# Altium project LimeNet-Micro_2v0.PrjPcb (part 9 of 9)
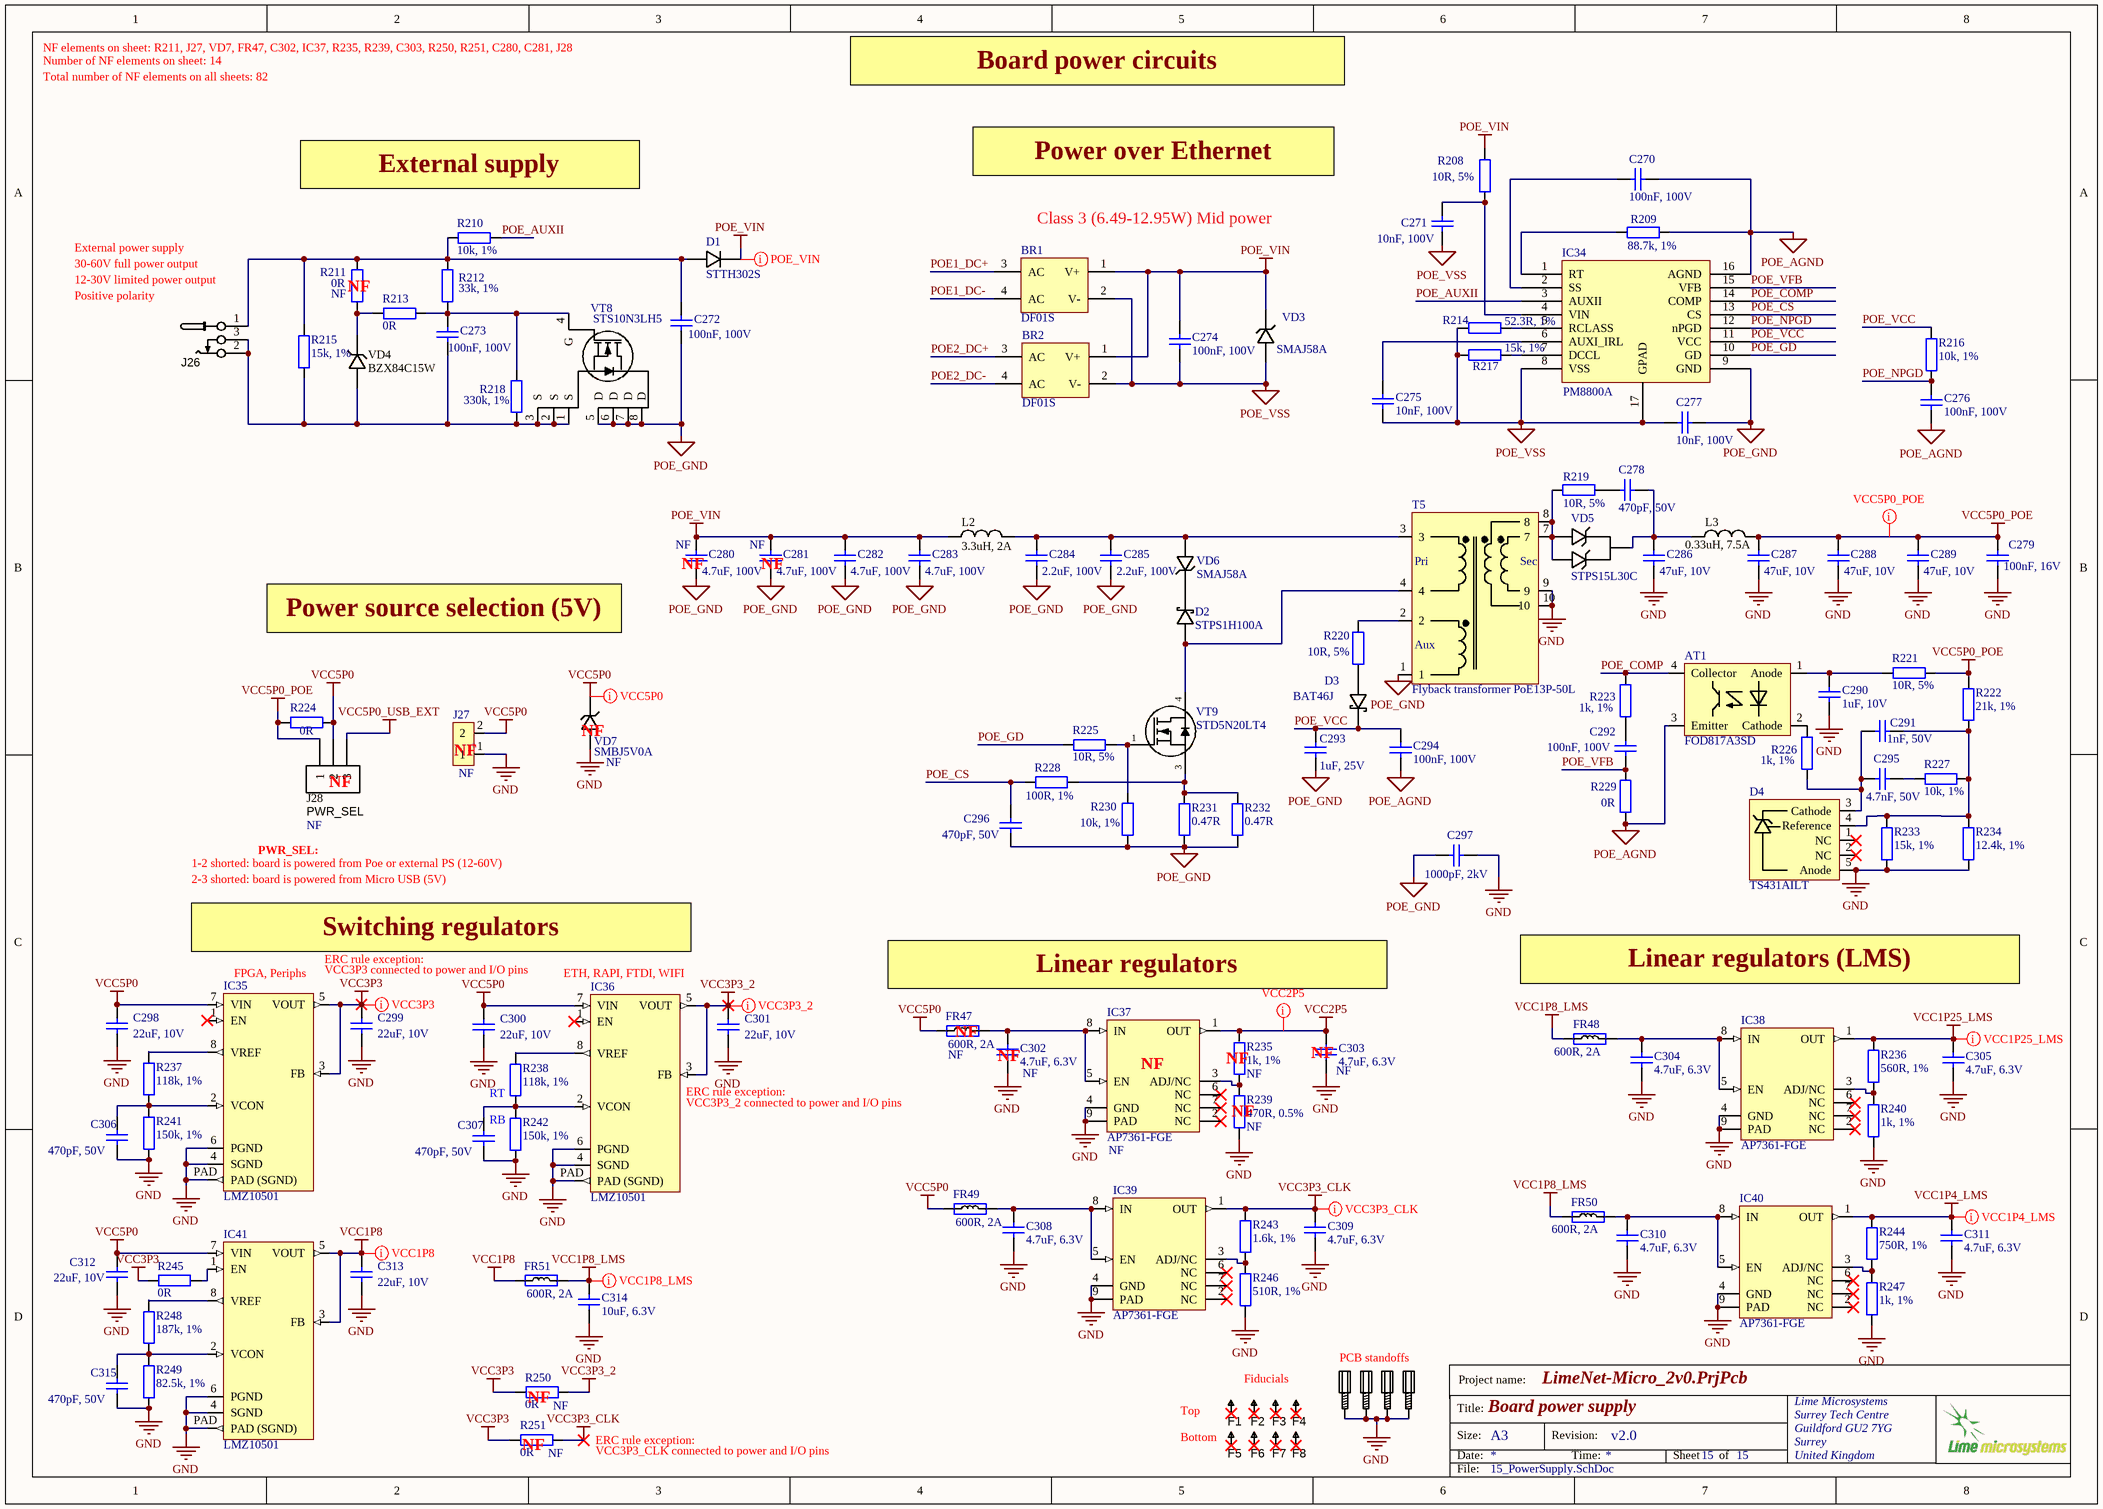
[diagram p16: 15_PowerSupply.SchDoc]

## Sheet 15_PowerSupply.SchDoc: Board power supply (continued)

### Library data of the parts (continued)
VD4 = BZX84C15W_DIODE_ZENER: Part Description: Zener Diode 15V 200mW ±6% Surface Mount SOT-323; Manufacturer: Diodes; Manufacturer Part Number 1: BZX84C15W-7-F; Max Power Dissipation: 200mW; Tolerance: 6%; Zener Voltage: 15V; Impedance: 30R; Max Reverse Leakage Current: 100nA; Zener Current: 5mA; Element Configuration: Single; Output Current: 23mA; ESD Protection: No; ComponentLink1URL: http://www.onsemi.com/pub/Collateral/BZX84C2V4LT1-D.PDF; ComponentLink1Description: http://www.onsemi.com/pub/Collateral/BZX84C2V4LT1-D.PDF; ComponentLink2URL: https://www.verical.com/server-webapp/html/getDatasheet?partID=101861; ComponentLink2Description: https://www.verical.com/server-webapp/html/getDatasheet?partID=101861; ComponentLink3URL: http://www.farnell.com/datasheets/1874542.pdf; ComponentLink3Description: http://www.farnell.com/datasheets/1874542.pdf; ComponentLink4URL: https://www.alliedelec.com/m/d/89a0f5fa5faf07909887b6182710b562.pdf; ComponentLink4Description: https://www.alliedelec.com/m/d/89a0f5fa5faf07909887b6182710b562.pdf; ComponentLink5URL: https://www.onsemi.com/pub/Collateral/BZX84C2V4LT1-D.PDF; ComponentLink5Description: https://www.onsemi.com/pub/Collateral/BZX84C2V4LT1-D.PDF; ComponentLink6URL: http://www.onsemi.com/pub_link/Collateral/BZX84C2V4LT1-D.PDF; ComponentLink6Description: http://www.onsemi.com/pub_link/Collateral/BZX84C2V4LT1-D.PDF; Supplier 1: Digi-Key; Stock 1: 4066; Pricing 1: 1=0.38, 10=0.284, 100=0.161, 500=0.1066, 1000=0.08173 (USD); Mount: Surface Mount; Case/Package: SOT-323; Number of Pins: 3; Weight: 0.000212oz; Contact Plating: Matte,Tin; Min Operating Temperature: -65°C; Max Operating Temperature: 125°C; Packaging: Tape and Reel; Package Quantity: 3000; Power Dissipation: 200mW; Voltage Tolerance: 6%; Test Current: 5mA; Termination: SMD/SMT; Peak Reverse Current: 100nA; Power Rating: 200mW; Voltage Rating (DC): 15V; Length: 2.2mm; Height: 1mm; Width: 1.35mm; Radiation Hardening: No; Lead Free: Lead Free; ComponentLink7URL: http://www.diodes.com/datasheets/ds30066.pdf; ComponentLink7Description: http://www.diodes.com/datasheets/ds30066.pdf; ComponentLink8URL: https://www.diodes.com/assets/Datasheets/ds30066.pdf; ComponentLink8Description: https://www.diodes.com/assets/Datasheets/ds30066.pdf; ComponentLink9URL: http://www.diodes.com//datasheets/ds30066.pdf; ComponentLink9Description: http://www.diodes.com//datasheets/ds30066.pdf; Supplier Part Number 1: BZX84C15W-FDIDKR-ND
VD5 = STPS15L30C_shottky_rectifier: Part Description: Diode Array 1 Pair Common Cathode Schottky 30V 7.5A Surface Mount TO-252-3, DPak (2 Leads + Tab), SC-63; Manufacturer: STMicroelectronics; Manufacturer Part Number 1: STPS15L30CB-TR; Element Configuration: Common Cathode; Forward Current: 15A; Peak Reverse Current: 1mA; Forward Voltage: 570mV; Average Rectified Current: 7.5A; Max Repetitive Reverse Voltage (Vrrm): 30V; Max Forward Surge Current (Ifsm): 75A; Supplier 1: Digi-Key; Stock 1: 5072; Pricing 1: 1=1.48, 10=1.327, 100=1.0343, 500=0.8544, 1000=0.67453 (USD); Mount: Surface Mount; Case/Package: DPAK; Number of Pins: 3; Contact Plating: Matte,Tin; Min Operating Temperature: -65°C; Max Operating Temperature: 150°C; Package Quantity: 2500; Packaging: Tape and Reel; Peak Non-Repetitive Surge Current: 75A; Current Rating: 15A; Voltage Rating (DC): 30V; Max Reverse Voltage (DC): 30V; Radiation Hardening: No; Lead Free: Lead Free; ComponentLink1URL: http://www.st.com/content/ccc/resource/technical/document/datasheet/1f/cc/d5/79/c8/b2/47/15/CD00002832.pdf/files/CD00002832.pdf/jcr:content/translations/en.CD00002832.pdf; ComponentLink1Description: http://www.st.com/content/ccc/resource/technical/document/datasheet/1f/cc/d5/79/c8/b2/47/15/CD00002832.pdf/files/CD00002832.pdf/jcr:content/translations/en.CD00002832.pdf; ComponentLink2URL: http://www.mouser.com/ds/2/389/stps15l30c-956623.pdf; ComponentLink2Description: http://www.mouser.com/ds/2/389/stps15l30c-956623.pdf; Supplier Part Number 1: 497-6574-6-ND
VD7 = DIODE_TVS_UNIDIR: SMAJ12CA-13-F; Manufacturer: ON Semiconductor; Part Description: TVS DIODE 5V 9.2V DO214AA; Voltage - Breakdown (Min): 6.4V; Type: Zener; Voltage - Clamping (Max) @ Ipp: 9.2V; Power Line Protection: No; Voltage - Reverse Standoff (Typ): 5V; Current - Peak Pulse (10/1000µs): 65.2A; Power - Peak Pulse: 600W; Category: Circuit Protection; Packaging: Cut Tape (CT); Operating Temperature: -55°C ~ 150°C (TJ); Package / Case: DO-214AA, SMB; Supplier Part Number 1: SMBJ5V0ACT-ND; Part Status: Discontinued at Digi-Key; Manufacturer Part Number 1: SMBJ5V0A; Supplier Device Package: DO-214AA (SMB); Mounting Type: Surface Mount; Supplier 1: Digi-Key; RoHS: RoHS Compliant; Base Part Number: SMBJ5V0; Applications: General Purpose; Capacitance @ Frequency: -; Value: SMBJ5V0A
VT8 = STS10N3LH5_NMOS: Part Description: N-Channel 30V 10A (Tc) 2.5W (Tc) Surface Mount 8-SO; Manufacturer: STMicroelectronics; Rds On Max: 21mR; Input Capacitance: 475pF; Rise Time: 22ns; Drain to Source Voltage (Vdss): 30V; Continuous Drain Current (ID): 10A; Max Power Dissipation: 2.5W; Turn-On Delay Time: 4ns; Turn-Off Delay Time: 13ns; Fall Time: 2.8ns; Gate to Source Voltage (Vgs): 22V; ComponentLink1URL: http://www.st.com/web/en/resource/technical/document/datasheet/CD00103832.pdf; ComponentLink1Description: http://www.st.com/web/en/resource/technical/document/datasheet/CD00103832.pdf; ComponentLink2URL: http://www.st.com/content/ccc/resource/technical/document/datasheet/00/75/48/c3/62/90/4a/32/CD00103832.pdf/files/CD00103832.pdf/jcr:content/translations/en.CD00103832.pdf; ComponentLink2Description: http://www.st.com/content/ccc/resource/technical/document/datasheet/00/75/48/c3/62/90/4a/32/CD00103832.pdf/files/CD00103832.pdf/jcr:content/translations/en.CD00103832.pdf; ComponentLink3URL: http://www.mouser.com/ds/2/389/CD00103832-114014.pdf; ComponentLink3Description: http://www.mouser.com/ds/2/389/CD00103832-114014.pdf; Supplier 1: Digi-Key; Manufacturer Part Number: STS10N3LH5; Stock 1: 4194; Pricing 1: 1=1.38, 10=1.219, 100=0.9632, 500=0.74698, 1000=0.58973 (USD); Mount: Surface Mount; Case/Package: SOIC; Number of Pins: 8; Min Operating Temperature: -55°C; Max Operating Temperature: 150°C; Package Quantity: 2500; Packaging: Tape and Reel; Radiation Hardening: No; Lead Free: Lead Free; ComponentLink4URL: http://www.st.com/web/en/resource/technical/document/datasheet/CD00232229.pdf; ComponentLink4Description: http://www.st.com/web/en/resource/technical/document/datasheet/CD00232229.pdf; ComponentLink5URL: http://www.st.com/content/ccc/resource/technical/document/datasheet/53/fc/cf/05/f9/85/43/7e/CD00232229.pdf/files/CD00232229.pdf/jcr:content/translations/en.CD00232229.pdf; ComponentLink5Description: http://www.st.com/content/ccc/resource/technical/document/datasheet/53/fc/cf/05/f9/85/43/7e/CD00232229.pdf/files/CD00232229.pdf/jcr:content/translations/en.CD00232229.pdf; Supplier Part Number 1: 497-10010-1-ND
VT9 = STD5N20LT4_NMOS: Manufacturer: STMicroelectronics; Part Description: N-Channel 200V 5A (Tc) 33W (Tc) Surface Mount DPAK; Nominal Vgs: 2.5V; Rise Time: 21.5ns; Rds On Max: 700mR; Input Capacitance: 242pF; Number of Elements: 1; Max Power Dissipation: 33W; Dual Supply Voltage: 200V; Continuous Drain Current (ID): 5A; Fall Time: 15.5ns; Drain to Source Resistance: 650mR; Turn-Off Delay Time: 14ns; Turn-On Delay Time: 11.5ns; Element Configuration: Single; Gate to Source Voltage (Vgs): 20V; Supplier 1: Digi-Key; Manufacturer Part Number 1: STD5N20LT4; Stock 1: 3027; Pricing 1: 1=1.17, 10=1.033, 100=0.8161, 500=0.6329, 1000=0.49965 (USD); Mount: Surface Mount; Case/Package: DPAK; Number of Pins: 3; Min Operating Temperature: -55°C; Max Operating Temperature: 150°C; Packaging: Tape and Reel; Package Quantity: 2500; Drain to Source Voltage (Vdss): 200V; Drain to Source Breakdown Voltage: 200V; Power Dissipation: 33W; On-State Resistance: 700mR; Threshold Voltage: 2.5V; Termination: SMD/SMT; Voltage Rating (DC): 200V; Current Rating: 5A; Length: 6.6mm; Height: 2.4mm; Width: 6.2mm; Radiation Hardening: No; REACH SVHC: No SVHC; Lead Free: Lead Free; ComponentLink1URL: http://www.farnell.com/datasheets/1689960.pdf; ComponentLink1Description: http://www.farnell.com/datasheets/1689960.pdf; ComponentLink2URL: http://www.st.com/content/ccc/resource/technical/document/datasheet/group2/51/4c/d5/e5/c6/ef/43/17/CD00043538/files/CD00043538.pdf/jcr:content/translations/en.CD00043538.pdf; ComponentLink2Description: http://www.st.com/content/ccc/resource/technical/document/datasheet/group2/51/4c/d5/e5/c6/ef/43/17/CD00043538/files/CD00043538.pdf/jcr:content/translations/en.CD00043538.pdf; ComponentLink3URL: http://www.st.com/web/en/resource/technical/document/datasheet/CD00043538.pdf; ComponentLink3Description: http://www.st.com/web/en/resource/technical/document/datasheet/CD00043538.pdf; Supplier Part Number 1: 497-4335-6-ND

## Nets that join several sheets
GND: 05_LMS7002M_Misc (17 pins), 06_LMS7002M_RF (44 pins), 07_LMS7002M_Power (84 pins), 08_FPGA (62 pins), 09_Misc (63 pins), 10_USB_Ethernet (47 pins), 11_USB_FIFO (33 pins), 12_Raspbbery CM3 (80 pins), 13_Raspberry_Misc (72 pins), 14_Clocks (74 pins), 15_PowerSupply (60 pins)
RAPI_VDAC: 12_Raspbbery CM3 (C197.2 J13.189 R133.1 R137.2), 13_Raspberry_Misc (VD2.2)
VCC1P4_LMS: 07_LMS7002M_Power (7 pins), 15_PowerSupply (C311.2 IC40.1 R244.1)
VCC1P8: 08_FPGA (11 pins), 09_Misc (R53.2 R79.1), 12_Raspbbery CM3 (R127.2 R134.1 R141.1), 13_Raspberry_Misc (5 pins), 14_Clocks (FR44.1), 15_PowerSupply (C313.2 FR51.1 IC41.3 IC41.5)
VCC1P8_LMS: 06_LMS7002M_RF (12 pins), 07_LMS7002M_Power (11 pins), 15_PowerSupply (C314.2 FR48.1 FR50.1 FR51.2)
VCC1P25_LMS: 07_LMS7002M_Power (18 pins), 15_PowerSupply (C305.2 IC38.1 R236.2)
VCC2P5: 12_Raspbbery CM3 (R137.1), 14_Clocks (R195.2), 15_PowerSupply (C303.2 IC37.1 R235.2)
VCC3P3: 05_LMS7002M_Misc (10 pins), 07_LMS7002M_Power (FR1.2), 08_FPGA (46 pins), 09_Misc (39 pins), 10_USB_Ethernet (J9.P6 J9.P12), 13_Raspberry_Misc (6 pins), 15_PowerSupply (6 pins)
VCC3P3_2: 10_USB_Ethernet (22 pins), 11_USB_FIFO (21 pins), 12_Raspbbery CM3 (13 pins), 13_Raspberry_Misc (19 pins), 15_PowerSupply (C301.2 IC36.3 IC36.5 R250.1)
VCC3P3_CLK: 09_Misc (FR36.1), 13_Raspberry_Misc (C215.1 IC28.5), 14_Clocks (12 pins), 15_PowerSupply (C309.2 IC39.1 R243.2 R251.1)
VCC5P0: 08_FPGA (J3.7 R43.1), 09_Misc (R71.1), 10_USB_Ethernet (5 pins), 11_USB_FIFO (R114.2), 12_Raspbbery CM3 (R130.2), 13_Raspberry_Misc (5 pins), 15_PowerSupply (12 pins)
VCC5P0_USB_EXT: 10_USB_Ethernet (J12.4), 12_Raspbbery CM3 (J14.1 R132.1), 13_Raspberry_Misc (J15.1), 15_PowerSupply (J28.3)
ADF_MUXOUT: 08_FPGA (IC8.C10), 14_Clocks (IC32.15 R197.1)
BUZZER: 08_FPGA (IC8.D13), 09_Misc (R81.1 R83.1 VT2.G)
CAM1_CLK_N: 12_Raspbbery CM3 (J13.149), 13_Raspberry_Misc (J23.8)
CAM1_CLK_P: 12_Raspbbery CM3 (J13.147), 13_Raspberry_Misc (J23.9)
CAM1_D0_N: 12_Raspbbery CM3 (J13.161), 13_Raspberry_Misc (J23.2)
CAM1_D0_P: 12_Raspbbery CM3 (J13.159), 13_Raspberry_Misc (J23.3)
CAM1_D1_N: 12_Raspbbery CM3 (J13.155), 13_Raspberry_Misc (J23.5)
CAM1_D1_P: 12_Raspbbery CM3 (J13.153), 13_Raspberry_Misc (J23.6)
CAM1_GPIO0: 12_Raspbbery CM3 (J13.59), 13_Raspberry_Misc (J23.11)
CAM1_GPIO1: 12_Raspbbery CM3 (J13.57), 13_Raspberry_Misc (J23.12)
DSI1_CLK_N: 12_Raspbbery CM3 (J13.102), 13_Raspberry_Misc (J22.5)
DSI1_CLK_P: 12_Raspbbery CM3 (J13.100), 13_Raspberry_Misc (J22.6)
DSI1_D0_N: 12_Raspbbery CM3 (J13.96), 13_Raspberry_Misc (J22.8)
DSI1_D0_P: 12_Raspbbery CM3 (J13.94), 13_Raspberry_Misc (J22.9)
DSI1_D1_N: 12_Raspbbery CM3 (J13.120), 13_Raspberry_Misc (J22.2)
DSI1_D1_P: 12_Raspbbery CM3 (J13.118), 13_Raspberry_Misc (J22.3)
ETH_AUTOMDIX_EN: 09_Misc (IC15.3), 10_USB_Ethernet (IC20.41 R88.1)
ETH_CLK24: 10_USB_Ethernet (IC20.45), 14_Clocks (R178.2)
ETH_GPIO0: 08_FPGA (IC8.C2), 10_USB_Ethernet (R97.2)
ETH_GPIO1: 08_FPGA (IC8.G4), 10_USB_Ethernet (R100.2)
ETH_GPIO2: 08_FPGA (IC8.H1), 10_USB_Ethernet (R102.2)
ETH_LED1: 09_Misc (IC13.2), 10_USB_Ethernet (R99.1)
ETH_LED2: 09_Misc (IC13.3), 10_USB_Ethernet (R101.1)
ETH_NRESET: 09_Misc (IC15.4), 10_USB_Ethernet (IC20.12 R87.1)
ETH_USB0_D_N: 10_USB_Ethernet (IC20.58 J12.2), 13_Raspberry_Misc (IC27.2)
ETH_USB0_D_P: 10_USB_Ethernet (IC20.59 J12.3), 13_Raspberry_Misc (IC27.1)
ETH_USB5_D_N: 10_USB_Ethernet (IC20.8), 11_USB_FIFO (IC23.25)
ETH_USB5_D_P: 10_USB_Ethernet (IC20.9), 11_USB_FIFO (IC23.23)
FAN_CTRL: 08_FPGA (IC8.C5 R52.2), 09_Misc (VT1.G)
FPGA_BTN: 08_FPGA (IC8.H3), 09_Misc (C133.1 R79.2 SB1.1)
FPGA_I2C_SCL: 08_FPGA (IC8.K10), 09_Misc (6 pins), 12_Raspbbery CM3 (R136.1 R139.1)
FPGA_I2C_SDA: 08_FPGA (IC8.B10), 09_Misc (6 pins), 12_Raspbbery CM3 (R142.1 R143.1)
FPGA_SPI_ADF_SS: 09_Misc (IC15.15), 14_Clocks (R202.1)
FPGA_SPI_DAC_SS: 09_Misc (IC15.1), 14_Clocks (R205.2)
FPGA_SPI_LMS_SS: 05_LMS7002M_Misc (R9.2), 08_FPGA (IC8.J5)
FPGA_SPI_MISO: 05_LMS7002M_Misc (R8.2), 08_FPGA (IC8.N5), 09_Misc (IC19.2)
FPGA_SPI_MOSI: 05_LMS7002M_Misc (R7.2), 08_FPGA (IC8.K5), 09_Misc (IC19.5), 14_Clocks (R201.1 R207.2)
FPGA_SPI_SCLK: 05_LMS7002M_Misc (R6.2), 08_FPGA (IC8.M5), 09_Misc (IC19.6), 14_Clocks (R200.1 R206.2)
FT_BE0: 08_FPGA (IC8.H9), 11_USB_FIFO (IC23.4)
FT_BE1: 08_FPGA (IC8.G12), 11_USB_FIFO (IC23.5)
FT_BE2: 08_FPGA (IC8.H8), 11_USB_FIFO (IC23.6)
FT_BE3: 08_FPGA (IC8.K11), 11_USB_FIFO (IC23.7)
FT_CLK: 08_FPGA (IC8.G9), 11_USB_FIFO (IC23.58)
FT_D0: 08_FPGA (IC8.A2), 11_USB_FIFO (IC23.40)
FT_D1: 08_FPGA (IC8.A3), 11_USB_FIFO (IC23.41)
FT_D2: 08_FPGA (IC8.A4), 11_USB_FIFO (IC23.42)
FT_D3: 08_FPGA (IC8.A5), 11_USB_FIFO (IC23.43)
FT_D4: 08_FPGA (IC8.A6), 11_USB_FIFO (IC23.44)
FT_D5: 08_FPGA (IC8.A7), 11_USB_FIFO (IC23.45)
FT_D6: 08_FPGA (IC8.A8), 11_USB_FIFO (IC23.46)
FT_D7: 08_FPGA (IC8.A9), 11_USB_FIFO (IC23.47)
FT_D8: 08_FPGA (IC8.A12), 11_USB_FIFO (IC23.50)
FT_D9: 08_FPGA (IC8.B13), 11_USB_FIFO (IC23.51)
FT_D10: 08_FPGA (IC8.C13), 11_USB_FIFO (IC23.52)
FT_D11: 08_FPGA (IC8.B2), 11_USB_FIFO (IC23.53)
FT_D12: 08_FPGA (IC8.B3), 11_USB_FIFO (IC23.54)
FT_D13: 08_FPGA (IC8.B4), 11_USB_FIFO (IC23.55)
FT_D14: 08_FPGA (IC8.B5), 11_USB_FIFO (IC23.56)
FT_D15: 08_FPGA (IC8.B6), 11_USB_FIFO (IC23.57)
FT_D16: 08_FPGA (IC8.D9), 11_USB_FIFO (IC23.60)
FT_D17: 08_FPGA (IC8.E6), 11_USB_FIFO (IC23.61)
FT_D18: 08_FPGA (IC8.E8), 11_USB_FIFO (IC23.62)
FT_D19: 08_FPGA (IC8.F9), 11_USB_FIFO (IC23.63)
FT_D20: 08_FPGA (IC8.E9), 11_USB_FIFO (IC23.64)
FT_D21: 08_FPGA (IC8.E10), 11_USB_FIFO (IC23.65)
FT_D22: 08_FPGA (IC8.F8), 11_USB_FIFO (IC23.66)
FT_D23: 08_FPGA (IC8.B11), 11_USB_FIFO (IC23.67)
FT_D24: 08_FPGA (IC8.B12), 11_USB_FIFO (IC23.69)
FT_D25: 08_FPGA (IC8.C11), 11_USB_FIFO (IC23.70)
FT_D26: 08_FPGA (IC8.C12), 11_USB_FIFO (IC23.71)
FT_D27: 08_FPGA (IC8.F12), 11_USB_FIFO (IC23.72)
FT_D28: 08_FPGA (IC8.G13), 11_USB_FIFO (IC23.73)
FT_D29: 08_FPGA (IC8.H13), 11_USB_FIFO (IC23.74)
FT_D30: 08_FPGA (IC8.J13), 11_USB_FIFO (IC23.75)
FT_D31: 08_FPGA (IC8.L13), 11_USB_FIFO (IC23.76)
FT_OEn: 08_FPGA (IC8.J9), 11_USB_FIFO (IC23.13)
FT_RDn: 08_FPGA (IC8.D12), 11_USB_FIFO (IC23.12)
FT_RESETn: 09_Misc (IC15.5), 11_USB_FIFO (C167.1 IC23.15 R118.1)
FT_RXFn: 08_FPGA (IC8.K12), 11_USB_FIFO (IC23.9)
FT_TXEn: 08_FPGA (IC8.J12), 11_USB_FIFO (IC23.8)
FT_WAKEUPn: 08_FPGA (IC8.H10), 11_USB_FIFO (IC23.16 R117.1)
FT_WRn: 08_FPGA (IC8.E12), 11_USB_FIFO (IC23.11)
GNSS _UART_TX: 08_FPGA (IC8.D8 R49.2), 09_Misc (IC10.20 R66.2)
GNSS_TPULSE: 08_FPGA (IC8.J10), 09_Misc (IC10.3)
GNSS_UART_RX: 08_FPGA (IC8.L12), 09_Misc (IC10.21 R67.1)
GNSS_USB_D_N: 09_Misc (IC10.5), 10_USB_Ethernet (R108.2)
GNSS_USB_D_P: 09_Misc (IC10.6), 10_USB_Ethernet (R109.2)
HDMI_CEC: 12_Raspbbery CM3 (J13.171), 13_Raspberry_Misc (R160.2 VT7.S)
HDMI_CLK_N: 12_Raspbbery CM3 (J13.111), 13_Raspberry_Misc (J19.12)
HDMI_CLK_P: 12_Raspbbery CM3 (J13.113), 13_Raspberry_Misc (J19.10)
HDMI_D0_N: 12_Raspbbery CM3 (J13.117), 13_Raspberry_Misc (J19.9)
HDMI_D0_P: 12_Raspbbery CM3 (J13.119), 13_Raspberry_Misc (J19.7)
HDMI_D1_N: 12_Raspbbery CM3 (J13.123), 13_Raspberry_Misc (J19.6)
HDMI_D1_P: 12_Raspbbery CM3 (J13.125), 13_Raspberry_Misc (J19.4)
HDMI_D2_N: 12_Raspbbery CM3 (J13.129), 13_Raspberry_Misc (J19.3)
HDMI_D2_P: 12_Raspbbery CM3 (J13.131), 13_Raspberry_Misc (J19.1)
HDMI_HPD_N: 12_Raspbbery CM3 (J13.88), 13_Raspberry_Misc (R161.2 VT6.D)
HDMI_I2C_SCL: 12_Raspbbery CM3 (J13.175), 13_Raspberry_Misc (J19.15 VD1.A3)
HDMI_I2C_SDA: 12_Raspbbery CM3 (J13.173), 13_Raspberry_Misc (J19.16 VD1.B3)
LM75_OS: 08_FPGA (IC8.H2), 09_Misc (IC9.3 R53.1)
LMK_CLK: 08_FPGA (IC8.H6), 14_Clocks (IC30.15)
LMS_CORE_LDO_EN: 05_LMS7002M_Misc (IC1.U33 R5.1), 09_Misc (IC13.5)
LMS_DIQ1_D0: 05_LMS7002M_Misc (IC1.AG31), 08_FPGA (IC8.N12)
LMS_DIQ1_D1: 05_LMS7002M_Misc (IC1.AF30), 08_FPGA (IC8.M12)
LMS_DIQ1_D2: 05_LMS7002M_Misc (IC1.AF34), 08_FPGA (IC8.N11)
LMS_DIQ1_D3: 05_LMS7002M_Misc (IC1.AE31), 08_FPGA (IC8.L10)
LMS_DIQ1_D4: 05_LMS7002M_Misc (IC1.AD30), 08_FPGA (IC8.N9)
LMS_DIQ1_D5: 05_LMS7002M_Misc (IC1.AC29), 08_FPGA (IC8.M13)
LMS_DIQ1_D6: 05_LMS7002M_Misc (IC1.AE33), 08_FPGA (IC8.M10)
LMS_DIQ1_D7: 05_LMS7002M_Misc (IC1.AD32), 08_FPGA (IC8.N10)
LMS_DIQ1_D8: 05_LMS7002M_Misc (IC1.AC31), 08_FPGA (IC8.M8)
LMS_DIQ1_D9: 05_LMS7002M_Misc (IC1.AC33), 08_FPGA (IC8.M9)
LMS_DIQ1_D10: 05_LMS7002M_Misc (IC1.AB30), 08_FPGA (IC8.K6)
LMS_DIQ1_D11: 05_LMS7002M_Misc (IC1.AB32), 08_FPGA (IC8.K7)
LMS_DIQ2_D0: 05_LMS7002M_Misc (IC1.H30), 08_FPGA (IC8.M1)
LMS_DIQ2_D1: 05_LMS7002M_Misc (IC1.J31), 08_FPGA (IC8.L5)
LMS_DIQ2_D2: 05_LMS7002M_Misc (IC1.K30), 08_FPGA (IC8.K2)
LMS_DIQ2_D3: 05_LMS7002M_Misc (IC1.K32), 08_FPGA (IC8.M2)
LMS_DIQ2_D4: 05_LMS7002M_Misc (IC1.L31), 08_FPGA (IC8.M4)
LMS_DIQ2_D5: 05_LMS7002M_Misc (IC1.K34), 08_FPGA (IC8.J1)
LMS_DIQ2_D6: 05_LMS7002M_Misc (IC1.M30), 08_FPGA (IC8.L2)
LMS_DIQ2_D7: 05_LMS7002M_Misc (IC1.M32), 08_FPGA (IC8.K1)
LMS_DIQ2_D8: 05_LMS7002M_Misc (IC1.N31), 08_FPGA (IC8.N4)
LMS_DIQ2_D9: 05_LMS7002M_Misc (IC1.N33), 08_FPGA (IC8.J2)
LMS_DIQ2_D10: 05_LMS7002M_Misc (IC1.P30), 08_FPGA (IC8.L4)
LMS_DIQ2_D11: 05_LMS7002M_Misc (IC1.P32), 08_FPGA (IC8.N2)
LMS_ENABLE_IQSEL1: 05_LMS7002M_Misc (IC1.Y32), 08_FPGA (IC8.N7)
LMS_ENABLE_IQSEL2: 05_LMS7002M_Misc (IC1.R33), 08_FPGA (IC8.N3)
LMS_FCLK1: 05_LMS7002M_Misc (IC1.AA33), 08_FPGA (IC8.L3)
LMS_FCLK2: 05_LMS7002M_Misc (IC1.R29), 08_FPGA (IC8.M3)
LMS_MCLK1: 05_LMS7002M_Misc (IC1.AB34), 08_FPGA (IC8.G5)
LMS_MCLK2: 05_LMS7002M_Misc (IC1.P34), 08_FPGA (IC8.H4)
LMS_RESET: 05_LMS7002M_Misc (IC1.E27 R2.1), 09_Misc (IC13.4)
LMS_RXEN: 05_LMS7002M_Misc (IC1.V34 R4.2), 09_Misc (IC13.6)
LMS_TXEN: 05_LMS7002M_Misc (IC1.U29 R3.2), 09_Misc (IC13.7)
LMS_TXNRX1: 05_LMS7002M_Misc (IC1.V32 R1.1), 08_FPGA (IC8.N6)
LMS_TXNRX2: 05_LMS7002M_Misc (IC1.U31 R10.1), 08_FPGA (IC8.H5)
POE1_DC+: 10_USB_Ethernet (J9.P10), 15_PowerSupply (BR1.3)
POE1_DC-: 10_USB_Ethernet (J9.P11), 15_PowerSupply (BR1.4)
POE2_DC+: 10_USB_Ethernet (J9.P8), 15_PowerSupply (BR2.3)
POE2_DC-: 10_USB_Ethernet (J9.P9), 15_PowerSupply (BR2.4)
RAPI_EMMC_EN: 08_FPGA (IC8.E1), 12_Raspbbery CM3 (J13.90 R141.2 VT4.G)
RAPI_GPCLK0: 12_Raspbbery CM3 (J13.15), 14_Clocks (R175.2)
RAPI_GPCLK1: 10_USB_Ethernet (R95.2), 12_Raspbbery CM3 (J13.76)
RAPI_GPIO12: 08_FPGA (IC8.F10), 12_Raspbbery CM3 (J13.45)
RAPI_I2C1_SCL: 12_Raspbbery CM3 (J13.11 R139.2 R140.2), 13_Raspberry_Misc (J22.11 J23.13)
RAPI_I2C1_SDA: 12_Raspbbery CM3 (J13.9 R143.2 R144.2), 13_Raspberry_Misc (J22.12 J23.14)
RAPI_PWM0: 12_Raspbbery CM3 (J13.70), 13_Raspberry_Misc (IC28.3)
RAPI_PWM1: 12_Raspbbery CM3 (J13.72), 13_Raspberry_Misc (IC28.1)
RAPI_RUN: 09_Misc (IC15.6), 12_Raspbbery CM3 (R124.2)
RAPI_SD1_CLK: 12_Raspbbery CM3 (R252.2), 13_Raspberry_Misc (IC26.6)
RAPI_SD1_CMD: 12_Raspbbery CM3 (J13.54), 13_Raspberry_Misc (IC26.7)
RAPI_SD1_D0: 12_Raspbbery CM3 (J13.58), 13_Raspberry_Misc (IC26.2)
RAPI_SD1_D1: 12_Raspbbery CM3 (J13.60), 13_Raspberry_Misc (IC26.3)
RAPI_SD1_D2: 12_Raspbbery CM3 (J13.64), 13_Raspberry_Misc (IC26.4)
RAPI_SD1_D3: 12_Raspbbery CM3 (J13.66), 13_Raspberry_Misc (IC26.5)
RAPI_SDX_CLK: 12_Raspbbery CM3 (J13.10), 13_Raspberry_Misc (R149.1)
RAPI_SDX_CMD: 12_Raspbbery CM3 (J13.12), 13_Raspberry_Misc (R148.1)
RAPI_SDX_D0: 12_Raspbbery CM3 (J13.16), 13_Raspberry_Misc (R150.1)
RAPI_SDX_D1: 12_Raspbbery CM3 (J13.18), 13_Raspberry_Misc (R152.1)
RAPI_SDX_D2: 12_Raspbbery CM3 (J13.22), 13_Raspberry_Misc (R145.1)
RAPI_SDX_D3: 12_Raspbbery CM3 (J13.24), 13_Raspberry_Misc (R146.1)
RAPI_SPI0_CE0: 08_FPGA (IC8.E13), 12_Raspbbery CM3 (J13.27)
RAPI_SPI0_MISO: 08_FPGA (IC8.K8), 12_Raspbbery CM3 (J13.29)
RAPI_SPI0_MOSI: 08_FPGA (IC8.M11), 12_Raspbbery CM3 (J13.33)
RAPI_SPI0_SCLK: 08_FPGA (IC8.F13), 12_Raspbbery CM3 (J13.35)
RAPI_SPI1_CE0: 08_FPGA (IC8.A10), 12_Raspbbery CM3 (J13.63)
RAPI_SPI1_MISO: 08_FPGA (IC8.L11), 12_Raspbbery CM3 (J13.65)
RAPI_SPI1_MOSI: 08_FPGA (IC8.K13), 12_Raspbbery CM3 (J13.69)
RAPI_SPI1_SCLK: 08_FPGA (IC8.G10), 12_Raspbbery CM3 (J13.71)
RAPI_TVDAC: 12_Raspbbery CM3 (J13.166), 13_Raspberry_Misc (J21.1 VD2.3)
RAPI_UART0_RX: 12_Raspbbery CM3 (J13.53), 13_Raspberry_Misc (J17.3)
RAPI_UART0_TX: 12_Raspbbery CM3 (J13.51), 13_Raspberry_Misc (J17.2)
RAPI_UART1_RX: 09_Misc (R66.1), 12_Raspbbery CM3 (J13.48)
RAPI_UART1_TX: 09_Misc (R67.2), 12_Raspbbery CM3 (J13.46)
RAPI_USB_D_N: 12_Raspbbery CM3 (J13.167), 13_Raspberry_Misc (IC24.2)
RAPI_USB_D_P: 12_Raspbbery CM3 (J13.165), 13_Raspberry_Misc (IC24.1)
RFSW_RX_V1: 06_LMS7002M_RF (C24.2 IC7.5), 09_Misc (IC18.2)
RFSW_RX_V2: 06_LMS7002M_RF (C23.2 IC7.2), 09_Misc (IC18.3)
RFSW_TX_V1: 06_LMS7002M_RF (C16.2 IC5.5), 09_Misc (IC18.15)
RFSW_TX_V2: 06_LMS7002M_RF (C15.2 IC5.2), 09_Misc (IC18.1)
RxPLL_CLK: 05_LMS7002M_Misc (IC1.AM24), 14_Clocks (C227.2 R176.1)
SR_DIN: 08_FPGA (IC8.B7), 09_Misc (IC11.14)
SR_LATCH: 08_FPGA (IC8.D6), 09_Misc (5 pins)
SR_SCLK: 08_FPGA (IC8.B9 R48.2), 09_Misc (IC11.11 IC13.11 IC15.11 IC18.11)
TxPLL_CLK: 05_LMS7002M_Misc (IC1.E5), 14_Clocks (C226.2 R173.1)
USB_BOOT: 12_Raspbbery CM3 (5 pins), 13_Raspberry_Misc (VT5.G)
WIFI_PIO5: 08_FPGA (IC8.C9), 13_Raspberry_Misc (IC26.27)
WIFI_RST: 12_Raspbbery CM3 (J13.47), 13_Raspberry_Misc (R159.1)